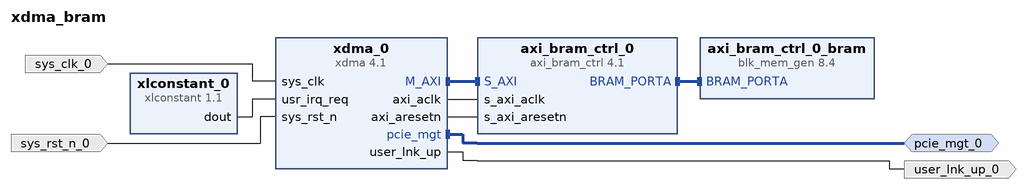
[diagram p0: block diagram of the top level]
# Vivado block design xdma_bram, xc7vx690tffg1761-3, Vivado 2023.2
create_bd_design xdma_bram

create_bd_intf_port -mode Master -vlnv xilinx.com:interface:pcie_7x_mgt_rtl:1.0 pcie_mgt_0
create_bd_port -dir O user_lnk_up_0
create_bd_port -dir I -type clk sys_clk_0
create_bd_port -dir I -type rst sys_rst_n_0

create_bd_cell -type ip -vlnv xilinx.com:ip:xdma:4.1 xdma_0
set_property -dict [list \
  CONFIG.PF0_DEVICE_ID_mqdma 9021 \
  CONFIG.PF0_SRIOV_VF_DEVICE_ID 0000 \
  CONFIG.PF2_DEVICE_ID_mqdma 9021 \
  CONFIG.PF3_DEVICE_ID_mqdma 9021 \
  CONFIG.axist_bypass_en true \
  CONFIG.axisten_freq 62.5 \
  CONFIG.cfg_mgmt_if false \
  CONFIG.copy_pf0 true \
  CONFIG.enable_gen4 false \
  CONFIG.pcie_blk_locn X0Y1 \
  CONFIG.pcie_extended_tag false \
  CONFIG.pf0_class_code_base 05 \
  CONFIG.pf0_class_code_interface 00 \
  CONFIG.pf0_class_code_sub 80 \
  CONFIG.pf0_device_id 7021 \
  CONFIG.pf0_interrupt_pin NONE \
  CONFIG.pf0_msi_enabled false \
  CONFIG.pf0_msix_cap_pba_offset 00008FE0 \
  CONFIG.pf0_msix_cap_table_offset 00008000 \
  CONFIG.pf0_msix_cap_table_size 01F \
  CONFIG.pf0_msix_enabled true \
  CONFIG.pf0_rbar_cap_bar0 0xffffffffffff \
  CONFIG.pf0_sub_class_interface_menu Generic_XT_compatible_serial_controller \
  CONFIG.pf1_rbar_cap_bar0 0xffffffffffff \
  CONFIG.pf2_rbar_cap_bar0 0xffffffffffff \
  CONFIG.pf3_rbar_cap_bar0 0xffffffffffff \
  CONFIG.pl_link_cap_max_link_speed 5.0_GT/s \
  CONFIG.plltype QPLL1 \
  CONFIG.runbit_fix false \
  CONFIG.xdma_num_usr_irq 16 \
] [get_bd_cells xdma_0]
create_bd_cell -type ip -vlnv xilinx.com:ip:axi_bram_ctrl:4.1 axi_bram_ctrl_0
set_property -dict {CONFIG.DATA_WIDTH 64 CONFIG.SINGLE_PORT_BRAM 1} [get_bd_cells axi_bram_ctrl_0]
create_bd_cell -type ip -vlnv xilinx.com:ip:xlconstant:1.1 xlconstant_0
set_property -dict {CONFIG.CONST_VAL 0 CONFIG.CONST_WIDTH 16} [get_bd_cells xlconstant_0]
create_bd_cell -type ip -vlnv xilinx.com:ip:blk_mem_gen:8.4 axi_bram_ctrl_0_bram

# ---- connections ----

connect_bd_intf_net [get_bd_intf_pins axi_bram_ctrl_0_bram/BRAM_PORTA] [get_bd_intf_pins axi_bram_ctrl_0/BRAM_PORTA]
connect_bd_intf_net [get_bd_intf_pins xdma_0/M_AXI] [get_bd_intf_pins axi_bram_ctrl_0/S_AXI]
connect_bd_intf_net [get_bd_intf_ports pcie_mgt_0] [get_bd_intf_pins xdma_0/pcie_mgt]
connect_bd_net -net sys_clk_0_1 [get_bd_ports sys_clk_0] [get_bd_pins xdma_0/sys_clk]
connect_bd_net -net sys_rst_n_0_1 [get_bd_ports sys_rst_n_0] [get_bd_pins xdma_0/sys_rst_n]
connect_bd_net [get_bd_pins xdma_0/axi_aclk] [get_bd_pins axi_bram_ctrl_0/s_axi_aclk]
connect_bd_net [get_bd_pins xdma_0/axi_aresetn] [get_bd_pins axi_bram_ctrl_0/s_axi_aresetn]
connect_bd_net [get_bd_pins xdma_0/user_lnk_up] [get_bd_ports user_lnk_up_0]
connect_bd_net [get_bd_pins xlconstant_0/dout] [get_bd_pins xdma_0/usr_irq_req]

# ---- address map ----
assign_bd_address -offset 0x0000000000000000 -range 512K -target_address_space [get_bd_addr_spaces xdma_0/M_AXI] [get_bd_addr_segs axi_bram_ctrl_0/S_AXI/Mem0]

validate_bd_design
save_bd_design
